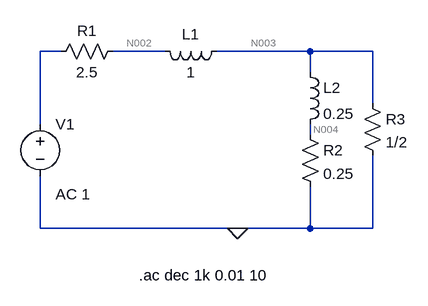
[diagram p0: schematic TS12_2_ZRL.asc]
TS12_2_ZRL.asc, the LTspice schematic file:
Version 4
SHEET 1 880 680
WIRE 32 96 0 96
WIRE 192 96 112 96
WIRE 416 96 272 96
WIRE 512 96 416 96
WIRE 416 128 416 96
WIRE 512 176 512 96
WIRE 0 208 0 96
WIRE 416 224 416 208
WIRE 0 368 0 288
WIRE 304 368 0 368
WIRE 416 368 416 304
WIRE 416 368 304 368
WIRE 512 368 512 256
WIRE 512 368 416 368
FLAG 304 368 0
SYMBOL res 128 80 R90
WINDOW 0 0 56 VBottom 2
WINDOW 3 32 56 VTop 2
SYMATTR InstName R1
SYMATTR Value 2.5
SYMBOL voltage 0 192 R0
WINDOW 123 24 124 Left 2
WINDOW 39 0 0 Left 0
SYMATTR InstName V1
SYMATTR Value ""
SYMATTR Value2 AC 1
SYMBOL ind 288 80 R90
WINDOW 0 5 56 VBottom 2
WINDOW 3 32 56 VTop 2
SYMATTR InstName L1
SYMATTR Value 1
SYMBOL res 400 208 R0
SYMATTR InstName R2
SYMATTR Value 0.25
SYMBOL ind 400 112 R0
SYMATTR InstName L2
SYMATTR Value 0.25
SYMBOL res 496 160 R0
SYMATTR InstName R3
SYMATTR Value 1/2
TEXT 152 440 Left 2 !.ac dec 1k 0.01 10

The netlist it stands for:
* TS12_2_ZRL.asc
R1 N002 N001 2.5
V1 N001 0 AC 1
L1 N003 N002 1
R2 N004 0 0.25
L2 N003 N004 0.25
R3 N003 0 1/2
.ac dec 1k 0.01 10
.backanno
.end

* Results of the author's LTspice run, read from the files saved beside the schematic
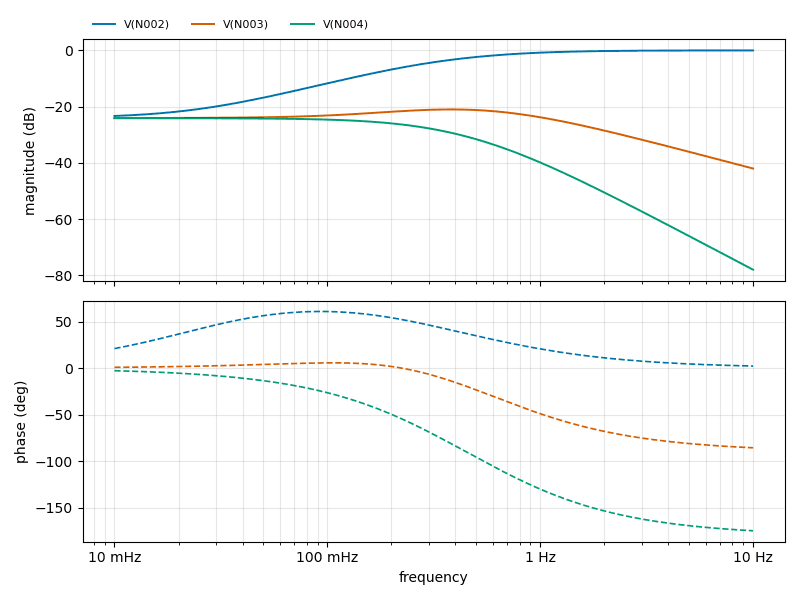
[diagram p1: AC Analysis of TS12_2_ZRL.asc, plotted from the saved traces]
* AC Analysis, 1 run:
*   V(N002): -23.32 dB at 10 mHz, -0.01 dB at 10 Hz, peak -0.01 dB at 10 Hz, 3 dB below the peak at 414.7 mHz
*   V(N003): -24.05 dB at 10 mHz, -42.01 dB at 10 Hz, peak -21.00 dB at 380.2 mHz, 3 dB below the peak at 22.5 mHz and 1.042 Hz
*   V(N004): -24.10 dB at 10 mHz, -77.97 dB at 10 Hz, peak -24.10 dB at 10 mHz, 3 dB below the peak at 267.2 mHz